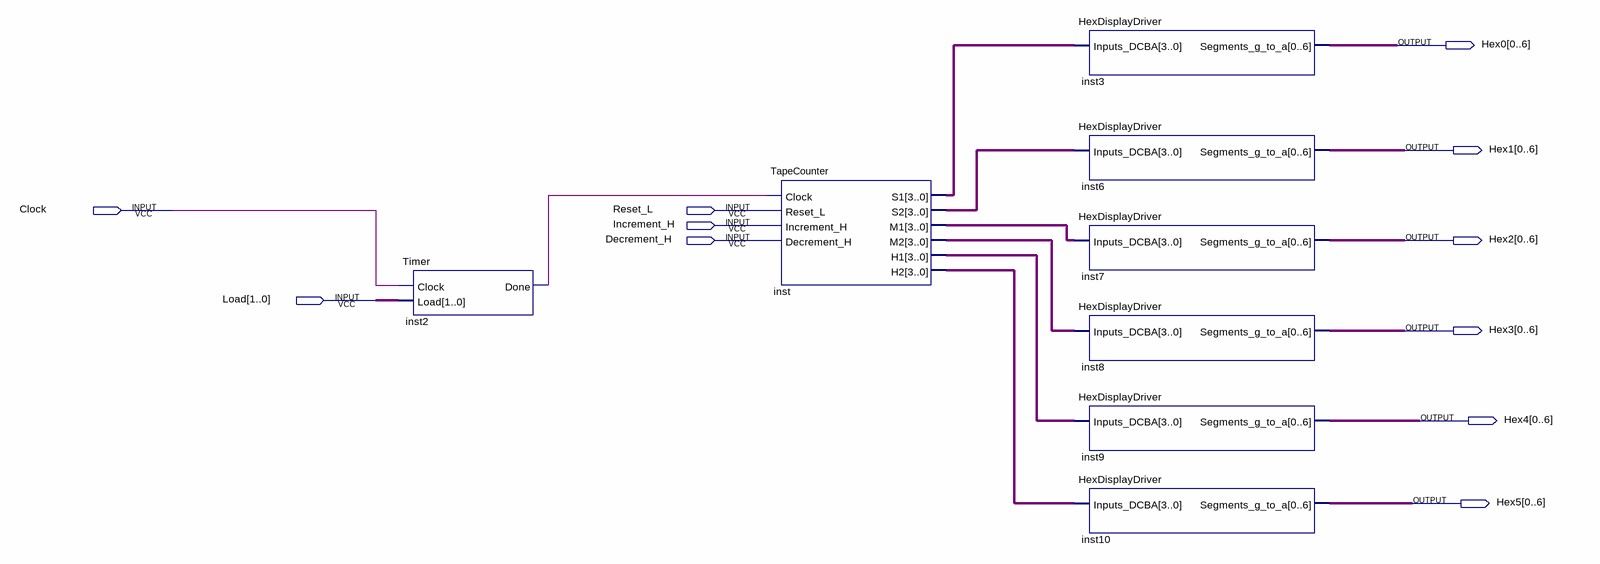
[diagram p0: schematic sheet]
// Quartus schematic TapeCounterDisplay.bdf as structural Verilog: 8 symbols, 11 pins
module TapeCounterDisplay (
  input  Clock,
  input  Reset_L,
  input  Increment_H,
  input  Decrement_H,
  input  [1:0] Load,
  output [0:6] Hex0,
  output [0:6] Hex1,
  output [0:6] Hex2,
  output [0:6] Hex3,
  output [0:6] Hex4,
  output [0:6] Hex5
);

  wire inst2_done;
  wire [3:0] inst_h1, inst_h2, inst_m1, inst_m2, inst_s1, inst_s2;

  Timer inst2 (.Clock(Clock), .Load(Load), .Done(inst2_done));
  TapeCounter inst (
    .Clock(inst2_done), .Reset_L(Reset_L), .Increment_H(Increment_H), .Decrement_H(Decrement_H),
    .S1(inst_s1), .S2(inst_s2), .M1(inst_m1), .M2(inst_m2), .H1(inst_h1), .H2(inst_h2));
  HexDisplayDriver inst3 (.Inputs_DCBA(inst_s1), .Segments_g_to_a(Hex0));
  HexDisplayDriver inst6 (.Inputs_DCBA(inst_s2), .Segments_g_to_a(Hex1));
  HexDisplayDriver inst7 (.Inputs_DCBA(inst_m1), .Segments_g_to_a(Hex2));
  HexDisplayDriver inst8 (.Inputs_DCBA(inst_m2), .Segments_g_to_a(Hex3));
  HexDisplayDriver inst9 (.Inputs_DCBA(inst_h1), .Segments_g_to_a(Hex4));
  HexDisplayDriver inst10 (.Inputs_DCBA(inst_h2), .Segments_g_to_a(Hex5));
endmodule
